# EAGLE design controller (EAGLE 6.1)
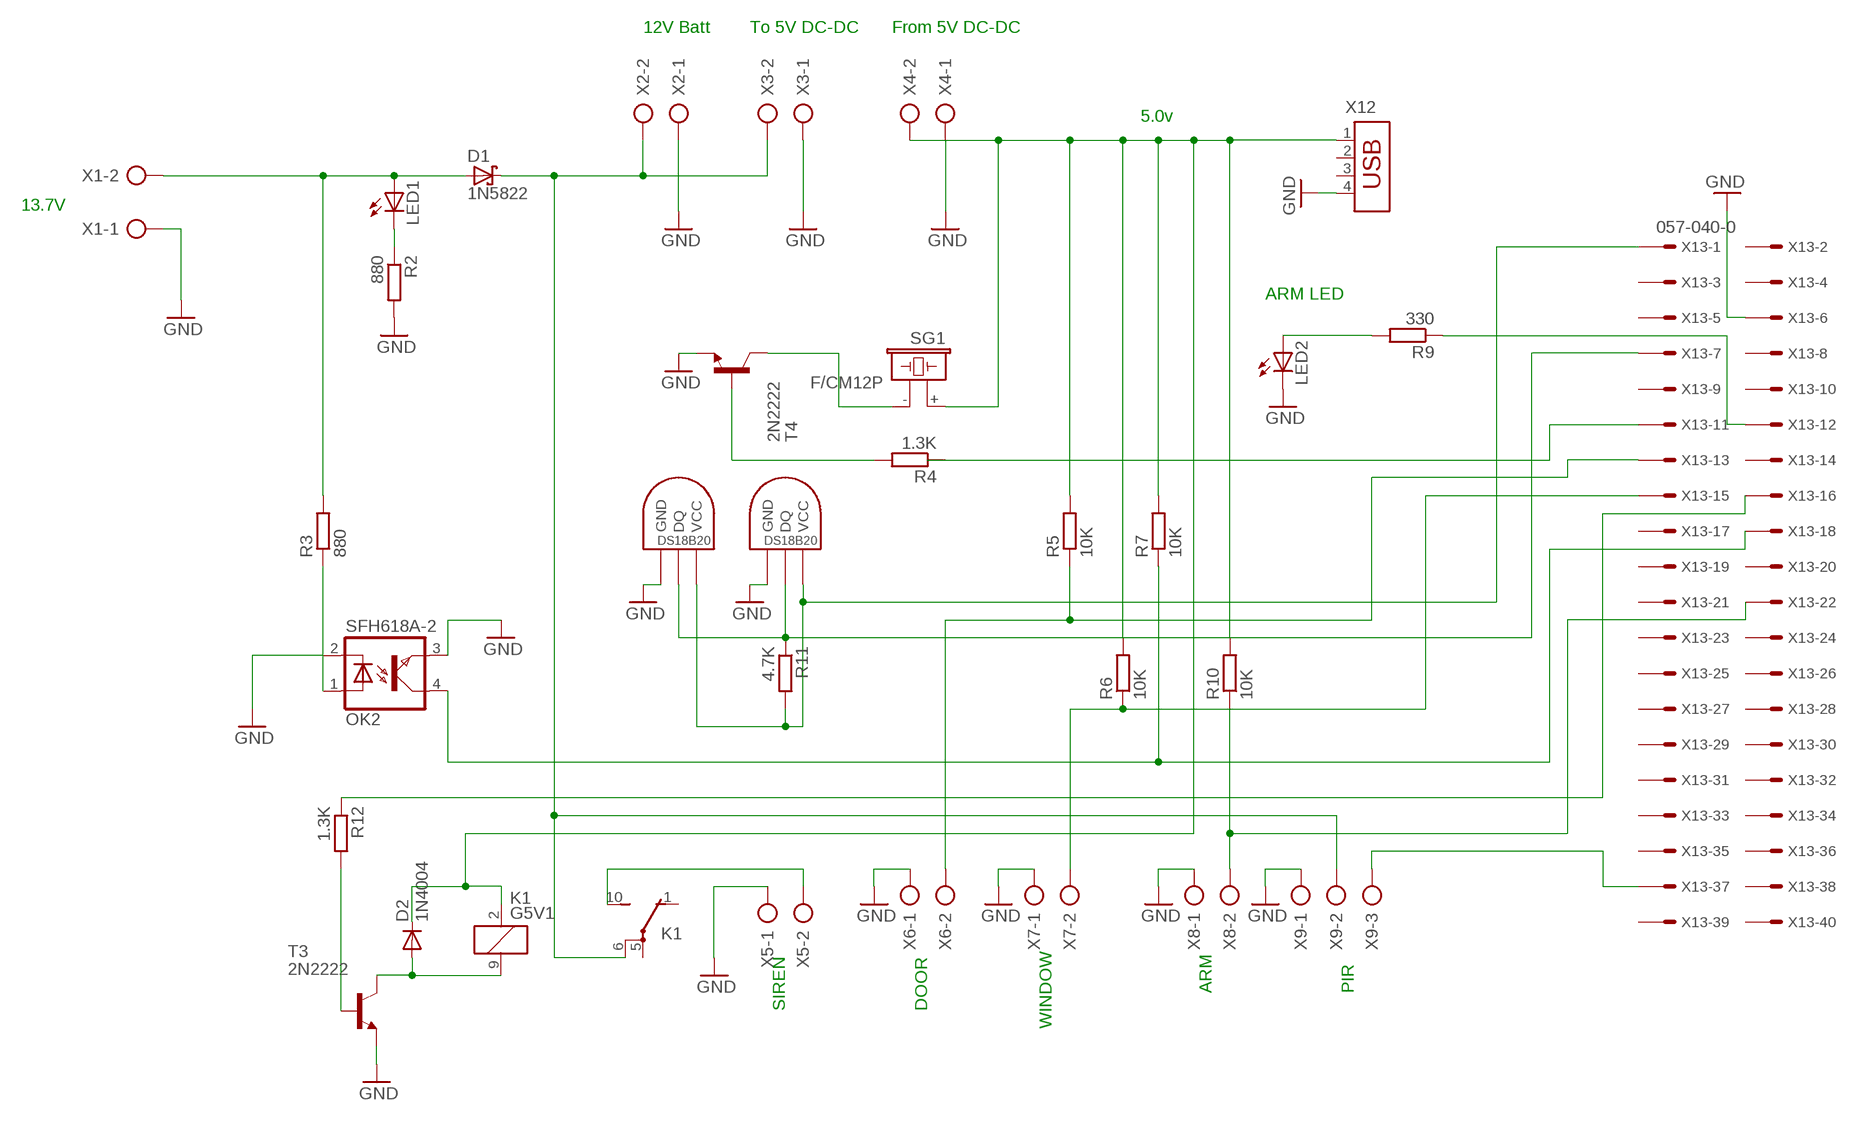
[diagram p0: schematic, sheet 1]

## Parts
D1  1N5822  SCHOTTKY-DIODEDO201T15  [DO201T15]
D2  1N4004  [DO41-10]
K1  G5V1  [G5V1]
LED1  LED5MM  [LED5MM]
LED2  LED5MM  [LED5MM]
OK2  SFH618A-2  [DIP4]
R2  880  R-EU_0204/7  [0204/7]
R3  880  R-EU_0204/7  [0204/7]
R4  1.3K  R-EU_0204/7  [0204/7]
R5  10K  R-EU_0204/7  [0204/7]
R6  10K  R-EU_0204/7  [0204/7]
R7  10K  R-EU_0204/7  [0204/7]
R9  330  R-EU_0204/7  [0204/7]
R10  10K  R-EU_0204/7  [0204/7]
R11  4.7K  R-EU_0204/7  [0204/7]
R12  1.3K  R-EU_0204/7  [0204/7]
SG1  F/CM12P  [F/CM12P]
T3  2N2222  2N2222-NPN-TO92-EBC  [TO92-EBC]
T4  2N2222  2N2222-NPN-TO92-EBC  [TO92-EBC]
U$1  DS1820TO92  [DS1820]
U$2  DS1820TO92  [DS1820]
X1  AK500/2  [AK500/2]
X2  AK500/2  [AK500/2]
X3  AK500/2  [AK500/2]
X4  AK500/2  [AK500/2]
X5  AK500/2  [AK500/2]
X6  AK500/2  [AK500/2]
X7  AK500/2  [AK500/2]
X8  AK500/2  [AK500/2]
X9  AK500/3-H  [AK500/3-H]
X12  USB-787616  [USB]
X13  057-040-0  [057-040-0]

## Nets
GND [fat 1.5mm]: LED2.K(C) OK2.2(C) OK2.3(EMIT) R2.2 T3.E T4.E U$1.GND U$2.GND X1.1 X2.1 X3.1 X4.1 X5.1 X6.1 X7.1 X8.1 X9.1 X12.4 X13.6
N$1: D1.A LED1.A R3.2 X1.2
N$2: R12.2 T3.B
N$3 [fat 2mm]: D2.A K1.9 T3.C
N$4 [fat 1.5mm]: D1.C K1.6(2:P) X2.2 X3.2 X9.2
N$5: X9.3 X13.37
N$6: R4.1 X13.11
N$7: LED1.K(C) R2.1
N$8: OK2.1(A) R3.1
N$9: OK2.4(COL) R7.1 X13.18
N$10: R4.2 T4.B
N$11: SG1.- T4.C
N$13: R5.1 X6.2 X13.13
N$15: R6.1 X7.2 X13.15
N$16: LED2.A R9.2
N$17: R9.1 X13.12
N$18: R10.1 X8.2 X13.22
N$19: R11.1 U$1.DQ U$2.DQ X13.7
N$20: R11.2 U$1.VDD(VCC) U$2.VDD(VCC) X13.1
N$21: R12.1 X13.16
N$22 [fat 1.5mm]: D2.C K1.2 R5.2 R6.2 R7.2 R10.2 SG1.+ X4.2 X12.1
N$23: K1.10(2:S) X5.2
Unconnected: K1.1(2:O) K1.5(2:P) X12.2 X12.3 X13.2 X13.3 X13.4 X13.5 X13.8 X13.9 X13.10 X13.14 X13.17 X13.19 X13.20 X13.21 X13.23 X13.24 X13.25 X13.26 X13.27 X13.28 X13.29 X13.30 X13.31 X13.32 X13.33 X13.34 X13.35 X13.36 X13.38 X13.39 X13.40

## Notes on the sheet
- 12V Batt | To 5V DC-DC | From 5V DC-DC
- 5.0v
- 13.7V
- ARM LED
- ARM | PIR
- SIREN | DOOR
- WINDOW

## Library data of the parts
D1 = diode:SCHOTTKY-DIODE: Schottky Diode
D2 = diode:1N4004: DIODE general purpose rectifier, 1 A
K1 = relay:G5V1: RELAY 1 x switch, 0.5 A/125 V AC, 1 A/24 V DC , Omron; MPN: G5V-1-DC24; OC_FARNELL: 9949593; OC_NEWARK: 36M6377
LED1 LED2 = led:LED: LED OSRAM: - CHIPLED LG R971, LG N971, LY N971, LG Q971, LY Q971, LO R971, LY R971 LH N974, LH R974 LS Q976, LO Q976, LY Q976 LO Q996 - Hyper CHIPLED LW Q18S LB Q993, LB Q99A, LB R99A - SideLED LS A670, LO A670, LY A670, LG A670, LP A670 LB A673, LV A673, LT A673, LW A673 LH A674 LY A675 LS A676, LA A676, LO A676, LY A676, LW A676 LS A679, LY A679, LG A679 - Hyper Micro SIDELED® LS Y876, LA Y876, LO Y876, LY Y876 LT Y87S - SmartLED LW L88C, LW L88S LB L89C, LB L89S, LG L890 LS L89K, LO L89K, LY L89K LS L896, LA L896, LO L896, LY L896 - TOPLED LS T670, LO T670, LY T670, LG T670, LP T670 LSG T670, LSP T670, LSY T670, LOP T670, LYG T670 LG T671, LOG T671, LSG T671 LB T673, LV T673, LT T673, LW T673 LH T674 LS T676, LA T676, LO T676, LY T676, LB T676, LH T676, LSB T676, LW T676 LB T67C, LV T67C, LT T67C, LS T67K, LO T67K, LY T67K, LW E67C LS E67B, LA E67B, LO E67B, LY E67B, LB E67C, LV E67C, LT E67C LW T67C LS T679, LY T679, LG T679 LS T770, LO T770, LY T770, LG T770, LP T770 LB T773, LV T773, LT T773, LW T773 LH T774 LS E675, LA E675, LY E675, LS T675 LS T776, LA T776, LO T776, LY T776, LB T776 LHGB T686 LT T68C, LB T68C - Hyper Mini TOPLED® LB M676 - Mini TOPLED Santana® LG M470 LS M47K, LO M47K, LY M47K Source: http://www.osram.convergy.de LUXEON: - LUMILED® LXK2-PW12-R00, LXK2-PW12-S00, LXK2-PW14-U00, LXK2-PW14-V00 LXK2-PM12-R00, LXK2-PM12-S00, LXK2-PM14-U00 LXK2-PE12-Q00, LXK2-PE12-R00, LXK2-PE12-S00, LXK2-PE14-T00, LXK2-PE14-U00 LXK2-PB12-K00, LXK2-PB12-L00, LXK2-PB12-M00, LXK2-PB14-N00, LXK2-PB14-P00, LXK2-PB14-Q00 LXK2-PR12-L00, LXK2-PR12-M00, LXK2-PR14-Q00, LXK2-PR14-R00 LXK2-PD12-Q00, LXK2-PD12-R00, LXK2-PD12-S00 LXK2-PH12-R00, LXK2-PH12-S00 LXK2-PL12-P00, LXK2-PL12-Q00, LXK2-PL12-R00 Source: www.luxeon.com KINGBRIGHT: KA-3528ASYC Source: www.kingbright.com
OK2 = optocoupler:SFH618?*: Optocoupler, Phototransistor Output, Low Input Current Source: Data sheet <http://www.vishay.com/docs/83673/sfh618.pdf>; MF: VISHAY/TELEFUNKEN; MPN: SFH618A-2; OC_FARNELL: 6424855; OC_NEWARK: 21H7744
R2-R7 R9-R12 = resistor:R-EU_: RESISTOR, European symbol
SG1 = buzzer:F/CM12P: BUZZER Source: Buerklin; OC_FARNELL: unknown; OC_NEWARK: unknown
T3 T4 = transistor-neu-to92:*-NPN-: NPN Transistror
U$1 U$2 = Ava:DS1820: DS18B20 Programmable Resolution 1-Wire Digital Thermometer Description The DS18B20 digital thermometer provides 9-bit to 12-bit Celsius temperature measurements and has an alarm function with nonvolatile user-programmable upper and lower trigger points. The DS18B20 communicates over a 1-Wire® bus that by definition requires only one data line (and ground) for communication with a central microprocessor. It has an operating temperature range of -55°C to +125°C and is accurate to ±0.5°C over the range of -10°C to +85°C. In addition, the DS18B20 can derive power directly from the data line ("parasite power"), eliminating the need for an external power supply. Each DS18B20 has a unique 64-bit serial code, which allows multiple DS18B20s to function on the same 1-Wire bus. Thus, it is simple to use one microprocessor to control many DS18B20s distributed over a large area. Applications that can benefit from this feature include HVAC environmental controls, temperature monitoring systems inside buildings, equipment, or machinery, and process monitoring and control systems.
X1-X8 = con-ptr500:AK500/2: CONNECTOR; OC_FARNELL: unknown; OC_NEWARK: unknown
X9 = con-ptr500:AK500/3-H: CONNECTOR Aug. 2004 / PTR Meßtechnik: Die Bezeichnung der Serie AK505 wurde geändert. Es handelt sich hierbei um AK500 in horizontaler Ausführung.; OC_FARNELL: unknown; OC_NEWARK: unknown
X12 = con-amp:USB-787616: AMP connector
X13 = con-panduit:057-040-: CONNECTOR 40-pin series 057 contact pc board low profile headers; OC_FARNELL: unknown; OC_NEWARK: unknown

## Net classes
0 default: width 1 mm
1 Ground: width 1 mm
2 fat 2mm: width 2 mm
3 fat 1.5mm: width 1.5 mm

## Board
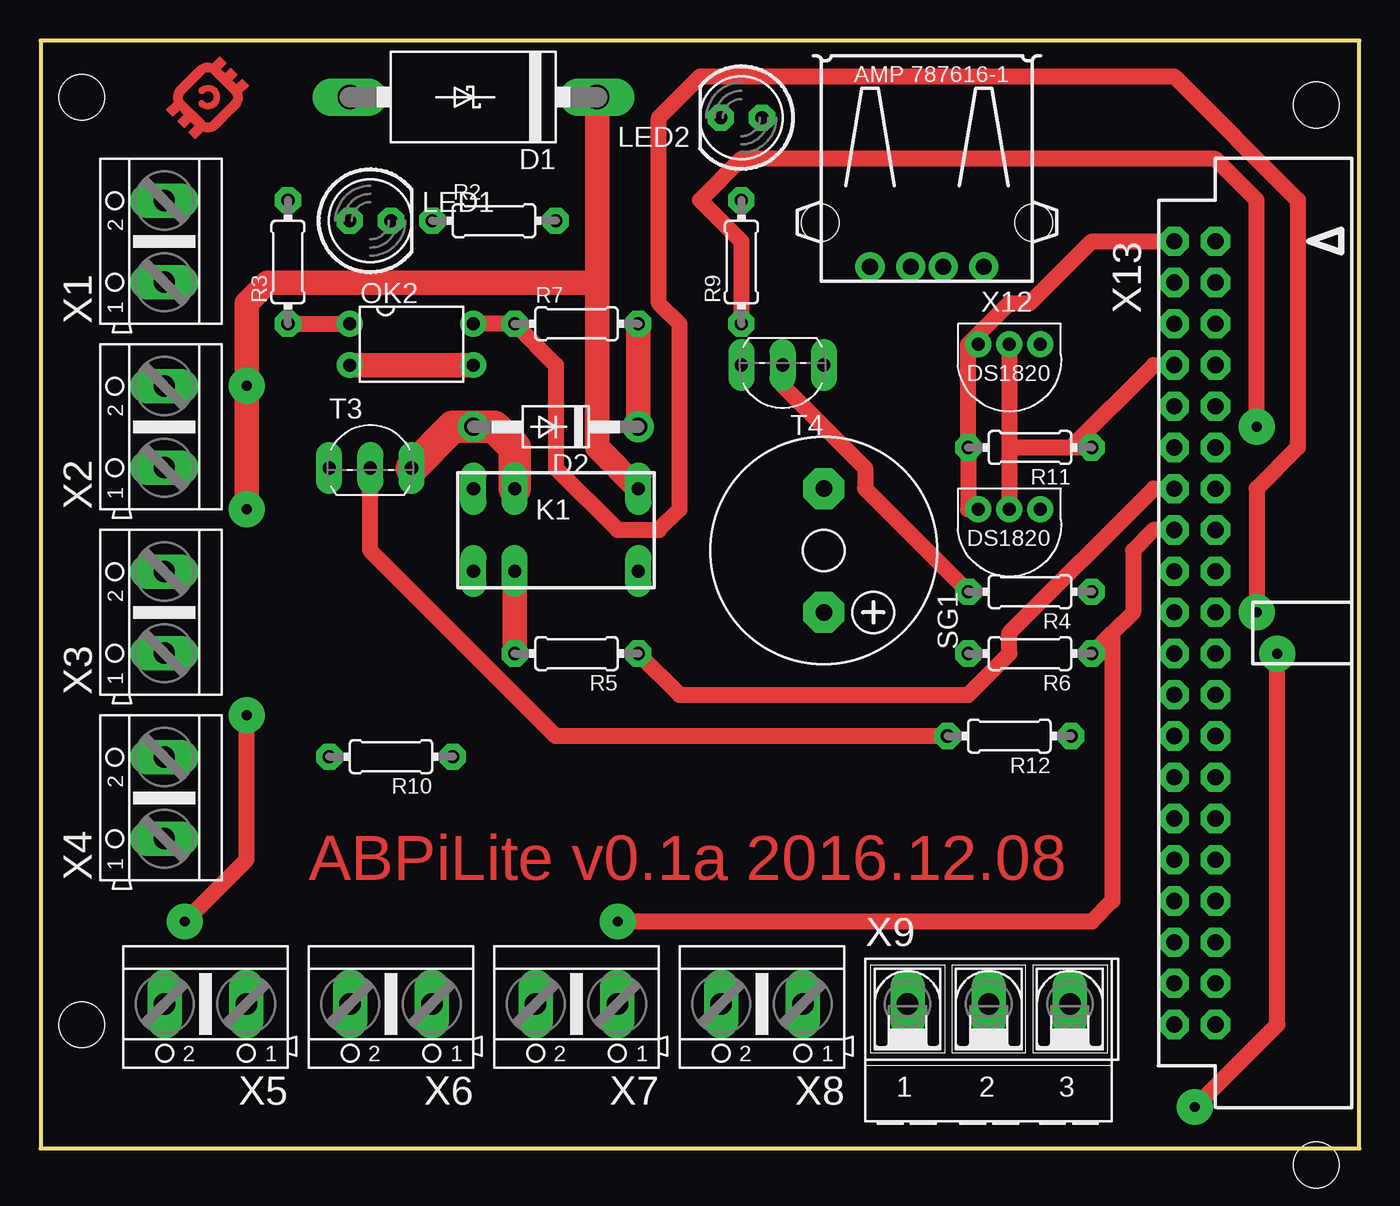
[diagram p1: board, top side]
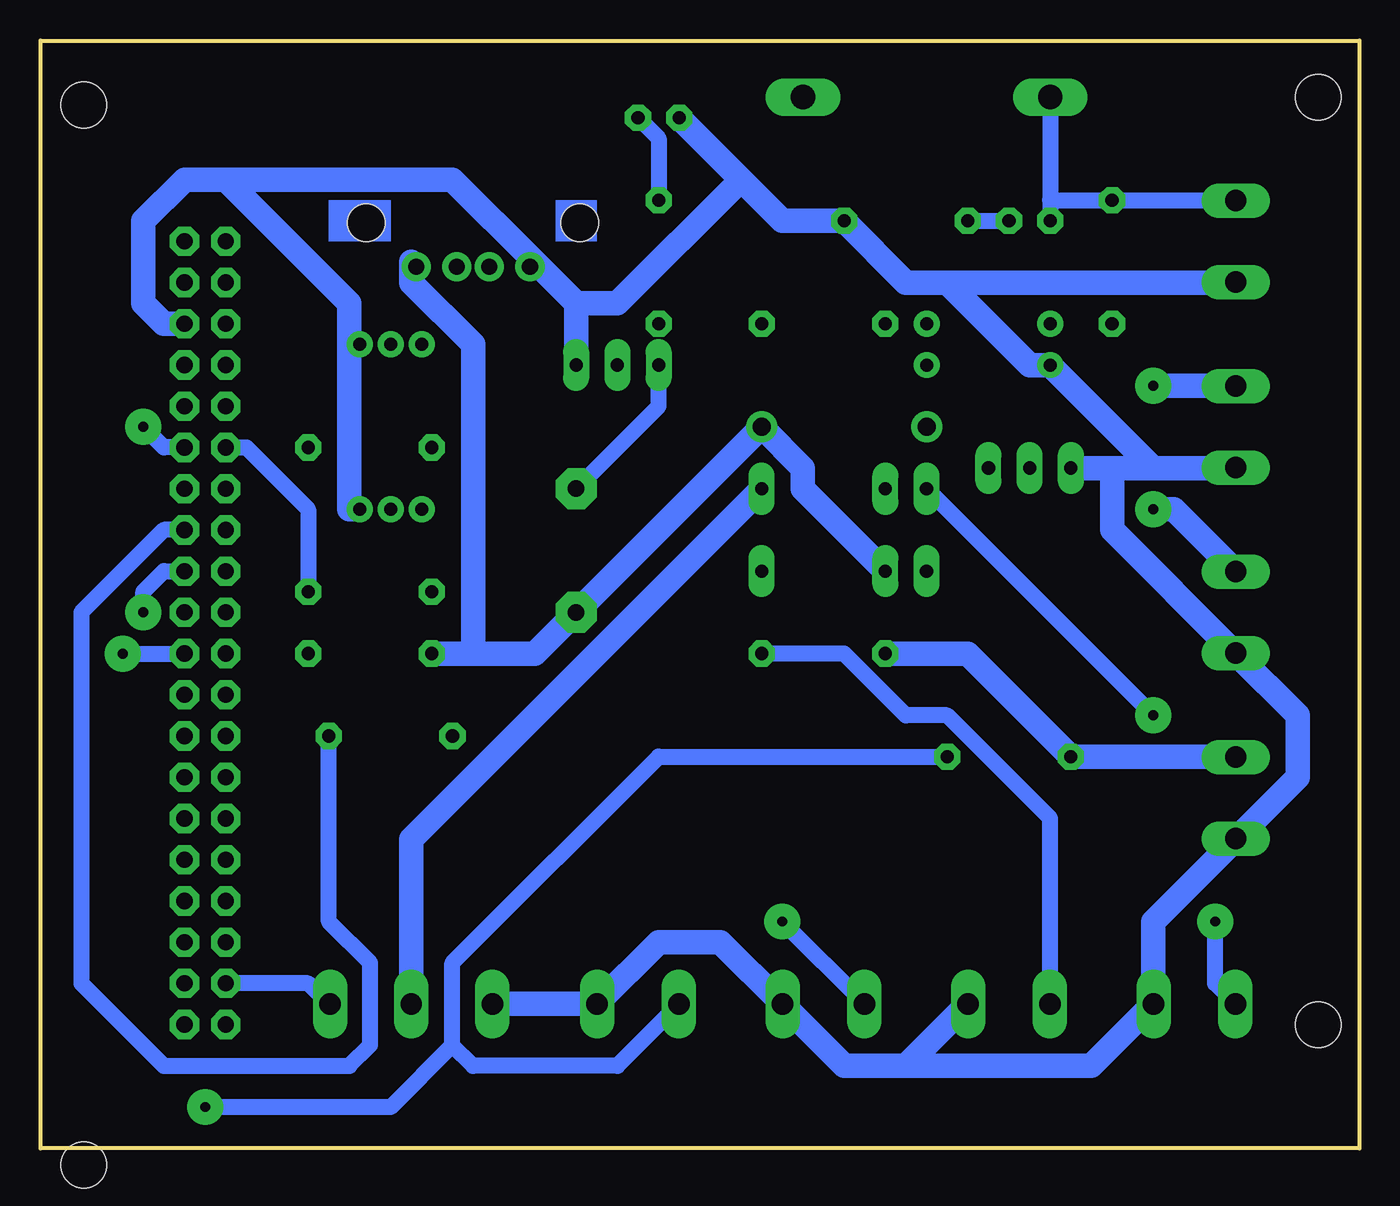
[diagram p2: board, bottom side, seen from below]

Size 81.26 x 68.25 mm. Coordinates in mm from the lower left corner, seen from the top.
Outline: 0,0 81.26,0 81.26,68.25 0,68.25 0,0
Copper layers (1*16): Top 0.035mm / dielectric 1.5mm / Bottom 0.035mm
Design rules: minimum track width 10mil, minimum drill 24mil, track to track 16mil, track to pad 16mil, pad to pad 16mil, via to via 16mil, smd to smd 8mil, copper to edge 40mil, drill to drill 8mil, minimum pad ring 0.4mm, minimum via ring 0.8mm, stop-mask expansion 4mil, vias tented up to drill 0mil, thermal gap 10mil
Holes 2.8 mm at 2.54,64.77 2.54,7.62
tRestrict: area 5.1,45.7 to 10.2,48.3; area 5.1,40.6 to 10.2,43.2; area 5.1,34.3 to 10.2,36.8; area 5.1,29.2 to 10.2,31.8; area 5.1,22.9 to 10.2,25.4; area 5.1,17.8 to 10.2,20.3; area 40.6,6.4 to 43.2,11.4; area 17.8,55.9 to 22.9,58.4; area 17.8,6.4 to 20.3,11.4; area 45.7,6.4 to 48.3,11.4; area 29.2,6.4 to 31.8,11.4; area 52.1,6.4 to 54.6,11.4; 19 more areas
vRestrict: area 3.8,16.5 to 11.4,61; area 5.1,5.1 to 67.3,12.7

### Footprints (pad centres in the part's own frame; a part is rotated, then mirrored left to right if it is on the bottom)
DO201T15 = drill 1.499 long: A 7.62,0; C -7.62,0
DO41-10 = drill 1.118: A 5.08,0; C -5.08,0
G5V1 = drill 0.813 long: 1 -5.08,-2.54; 2 -2.54,-2.54; 5 5.08,-2.54; 6 5.08,2.54; 9 -2.54,2.54; 10 -5.08,2.54
LED5MM = drill 0.813 octagon: A -1.27,0; K 1.27,0
DIP4 = drill 0.8: 1 -1.27,-3.81; 2 1.27,-3.81; 3 1.27,3.81; 4 -1.27,3.81
0204/7 = drill 0.813 octagon: 1 -3.81,0; 2 3.81,0
F/CM12P = drill 1.016 pad 2.54 octagon: + 3.81,0; - -3.81,0
TO92-EBC = drill 0.813 long: B 0,-1.27; C 2.54,-1.27; E -2.54,-1.27
DS1820 = drill 0.8: DQ 2.54,-1.27; GND 0.635,-1.27; VDD 4.445,-1.27
AK500/2 = drill 1.321 long: 1 -2.515,0; 2 2.515,0
AK500/3-H = drill 1.321 long: 1 -5.004,0; 2 0,0; 3 5.004,0
USB = drill 1: 1 -3.5,12.99; 2 -1,12.99; 3 1,12.99; 4 3.5,12.99 | hole 2.3: -6.57,10.28; 6.57,10.28
057-040-0 = drill 1 octagon: 1 -24.13,-5.08; 2 -24.13,-2.54; 3 -21.59,-5.08; 4 -21.59,-2.54; 5 -19.05,-5.08; 6 -19.05,-2.54; 7 -16.51,-5.08; 8 -16.51,-2.54; 9 -13.97,-5.08; 10 -13.97,-2.54; 11 -11.43,-5.08; 12 -11.43,-2.54; 13 -8.89,-5.08; 14 -8.89,-2.54; 15 -6.35,-5.08; 16 -6.35,-2.54; 17 -3.81,-5.08; 18 -3.81,-2.54; 19 -1.27,-5.08; 20 -1.27,-2.54; 21 1.27,-5.08; 22 1.27,-2.54; 23 3.81,-5.08; 24 3.81,-2.54; 25 6.35,-5.08; 26 6.35,-2.54; 27 8.89,-5.08; 28 8.89,-2.54; 29 11.43,-5.08; 30 11.43,-2.54; 31 13.97,-5.08; 32 13.97,-2.54; 33 16.51,-5.08; 34 16.51,-2.54; 35 19.05,-5.08; 36 19.05,-2.54; 37 21.59,-5.08; 38 21.59,-2.54; 39 24.13,-5.08; 40 24.13,-2.54 | hole 2.8: -32.53,3.66; 32.78,3.66

### Placement (x,y rotation side)
D1  26.67,64.77 180 top
D2  31.75,44.45 180 top
K1  31.75,38.1 0 top
LED1  20.32,57.15 0 top
LED2  43.18,63.5 180 top
OK2  22.86,49.53 270 top
R2  27.94,57.15 0 top
R3  15.24,54.61 90 top
R4  60.96,34.29 180 top
R5  33.02,30.48 180 top
R6  60.96,30.48 180 top
R7  33.02,50.8 0 top
R9  43.18,54.61 90 top
R10  21.59,24.13 180 top
R11  60.96,43.18 180 top
R12  59.69,25.4 180 top
SG1  48.26,36.83 270 top
T3  20.32,43.18 0 top
T4  45.72,46.99 180 top
U$1  62.23,48.26 180 top
U$2  62.23,38.1 180 top
U$3  [OPEN_HARDWARE_LOGO]  10.16,64.77 0 top
X1  7.62,55.88 90 top
X2  7.62,44.45 90 top
X3  7.62,33.02 90 top
X4  7.62,21.59 90 top
X5  10.16,8.89 180 top
X6  21.59,8.89 180 top
X7  33.02,8.89 180 top
X8  44.45,8.89 180 top
X9  58.42,8.89 0 top
X12  54.61,67.31 180 top
X13  74.93,31.75 270 top

### Tracks (layer width: path | path; a pad name or v marks a point on that pad's centre or on a via)
GND
  Top 1.5: OK2.3 OK2.2
  Bottom 1.5: 7.62,19.05 12.7,13.97 12.7,8.89 | X9.1 46.99,8.89 | 27.94,5.08 24.13,8.89 X6.1 | 27.94,5.08 31.75,5.08 35.56,8.89 | 46.99,8.89 43.18,12.7 39.37,12.7 35.56,8.89 | 46.99,8.89 X8.1 | 35.56,8.89 X7.1 | 12.7,8.89 16.51,5.08 27.94,5.08 | 12.7,8.89 X5.1 | 62.23,49.53 62.23,39.37 U$2.GND | 48.26,52.07 T4.E | 50.8,54.61 48.26,52.07 | X13.6 73.66,50.8 74.93,52.07 74.93,57.15 72.39,59.69 69.85,59.69 | 69.85,59.69 55.88,59.69 50.8,54.61 | 50.8,54.61 X12.4 | 62.23,49.53 62.23,52.07 69.85,59.69 | 62.23,49.53 U$1.GND | 12.7,41.91 7.62,41.91 X2.1 | 12.7,41.91 15.24,41.91 | 15.24,41.91 T3.E | 7.62,30.48 15.24,38.1 15.24,41.91 | 12.7,41.91 OK2.2 20.32,48.26 25.4,53.34 | LED2.K 38.1,59.69 | 38.1,59.69 35.56,57.15 R2.2 27.94,53.34 25.4,53.34 | 25.4,53.34 7.62,53.34 X1.1 | 48.26,52.07 45.72,52.07 38.1,59.69 | 7.62,19.05 3.81,22.86 3.81,26.67 7.62,30.48 | 7.62,19.05 X4.1 | 7.62,30.48 X3.1
N$1
  Bottom 1: D1.A 19.05,58.42 | 19.05,58.42 LED1.A | 19.05,58.42 R3.2 7.62,58.42 X1.2
N$2
  Top 1: T3.B 20.32,36.83 31.75,25.4 R12.2
N$3
  Top 2: T3.C 25.4,44.45 D2.A 27.94,44.45 29.21,43.18 K1.9
N$4  (via drill 0.61)
  Top 1.5: K1.6 34.29,43.18 34.29,53.34 | D1.C 34.29,53.34 | v12.7,39.37 v12.7,46.99 12.7,52.07 13.97,53.34 34.29,53.34
  Bottom 1.5: X9.2 58.42,19.05 K1.6 | v12.7,39.37 11.43,39.37 7.62,35.56 X3.2 | v12.7,46.99 7.62,46.99 X2.2
N$5
  Bottom 1: X13.37 64.77,10.16 63.5,8.89 X9.3
N$6
  Bottom 1: R4.1 64.77,39.37 68.58,43.18 X13.11
N$7
  Bottom 1: R2.1 LED1.K
N$8
  Top 1: R3.1 OK2.1
N$9  (via drill 0.61)
  Top 1: OK2.4 R7.1 31.75,48.26 31.75,41.91 35.56,38.1 38.1,38.1 39.37,39.37 39.37,50.8 38.1,52.07 38.1,63.5 40.64,66.04 69.85,66.04 77.47,58.42 77.47,43.18 74.93,40.64 v74.93,33.02
  Bottom 1: X13.18 73.66,35.56 74.93,34.29 v74.93,33.02
N$10
  Top 1: R4.2 50.8,40.64 50.8,41.91 45.72,46.99 T4.B
N$11
  Bottom 1: T4.C 43.18,45.72 SG1.-
N$13
  Top 1: X13.13 68.58,40.64 59.69,31.75 59.69,30.48 57.15,27.94 39.37,27.94 R5.1
  Bottom 1: R5.1 31.75,30.48 27.94,26.67 25.4,26.67 19.05,20.32 19.05,8.89 X6.2
N$15  (via drill 0.61)
  Top 1: 66.04,31.75 67.31,33.02 67.31,36.83 68.58,38.1 X13.15 | 66.04,31.75 R6.1 | v35.56,13.97 64.77,13.97 66.04,15.24 66.04,31.75
  Bottom 1: v35.56,13.97 30.48,8.89 X7.2
N$16
  Bottom 1: R9.2 43.18,62.23 LED2.A
N$17  (via drill 0.61)
  Top 1: R9.1 43.18,55.88 40.64,58.42 43.18,60.96 72.39,60.96 74.93,58.42 v74.93,44.45
  Bottom 1: v74.93,44.45 73.66,43.18 X13.12
N$18  (via drill 0.61)
  Top 1: v76.2,30.48 76.2,7.62 v71.12,2.54
  Bottom 1: R10.1 43.18,24.13 55.88,11.43 55.88,6.35 | 55.88,6.35 54.61,5.08 45.72,5.08 41.91,8.89 X8.2 | v76.2,30.48 X13.22 | v71.12,2.54 59.69,2.54 55.88,6.35
N$19
  Top 1: U$1.DQ 59.69,43.18 | 59.69,43.18 U$2.DQ | 59.69,43.18 63.5,43.18 | 63.5,43.18 R11.1 | X13.7 68.58,48.26 63.5,43.18
N$20
  Top 1: U$2.VDD 57.15,39.37 R11.2 57.15,49.53 | X13.1 64.77,55.88 60.96,52.07 59.69,52.07 57.15,49.53 | 57.15,49.53 U$1.VDD
N$21
  Bottom 1: R12.1 63.5,13.97 60.96,11.43 60.96,6.35 62.23,5.08 73.66,5.08 78.74,10.16 78.74,33.02 73.66,38.1 X13.16
N$22
  Top 1.5: K1.2 R5.2 | D2.C R7.2
  Bottom 1.5: X4.2 7.62,24.13 R10.2 24.13,30.48 R5.2 | 54.61,30.48 50.8,30.48 SG1.+ D2.C 34.29,41.91 34.29,40.64 K1.2 | 54.61,30.48 R6.2 | 54.61,30.48 54.61,49.53 58.42,53.34 58.42,54.61 X12.1
N$23  (via drill 0.61)
  Top 1: v12.7,26.67 12.7,17.78 v8.89,13.97
  Bottom 1: v12.7,26.67 K1.10 | v8.89,13.97 8.89,10.16 7.62,8.89 X5.2
(copper drawn outside any net)
  shapes: Bottom area x2

### Text on the board
Top: ABPiLite v0.1a 2016.12.08